# Altium schematic sheet PowerStage.SchDoc: Controlador PID
size A4; Organization: Altium Limited; Address1: L3, 12a Rodborough Rd; Address2: Frenchs Forest; Address3: NSW; Address4: Australia 2086; Revision: R00; sheetnumberh: 3; sheettotall: 5; Alumno: Irumberry Juan - Matwiejczuk Leandro; Curso: 512; Materia: Técnicas Digitales III; Docentes: Ing. Marín Ariel; SheetNumber: 3; SheetTotal: 5
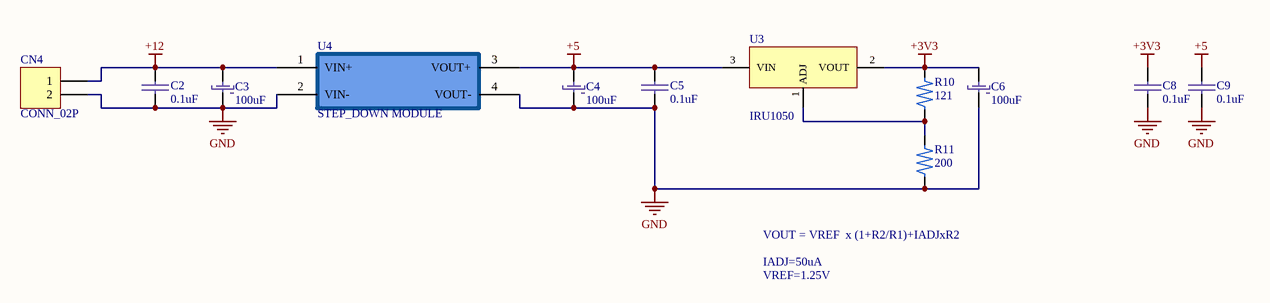
[diagram p0: PowerStage.SchDoc]

## Parts
C2  0.1uF  [CAP_Axial_0.2mm]
C3  100uF  [C_RAD_11MM]
C4  100uF  [C_RAD_5mm]
C5  0.1uF  [CAP_Axial_0.2mm]
C6  100uF  [C_RAD_5mm]
C8  0.1uF  [CAP_Axial_0.2mm]
C9  0.1uF  [CAP_Axial_0.2mm]
CN4  CONN_02P  [TERMINAL_BLOCK_2_PIN]
R10  121  [RES_AXIAL_3.2_6MM]
R11  200  [RES_AXIAL_3.2_6MM]
U3  IRU1050  [IRU1050]
U4  STEP_DOWN MODULE  [STEP_DOWN_MODULE]

## Nets
+3V3: C6.1 C8.1 R10.2 U3.2(VOUT)
+5: C4.1 C5.1 C9.1 U3.3(VIN) U4.3(VOUT+)
+12: C2.1 C3.1 CN4.1 U4.1(VIN+)
GND: C2.2 C3.2 C4.2 C5.2 C6.2 C8.2 C9.2 CN4.2 R11.1 U4.2(VIN-) U4.4(VOUT-)
NetR10_1: R10.1 R11.2 U3.1(ADJ)

## Notes on the sheet
- VOUT = VREF  x (1+R2/R1)+IADJxR2
- IADJ=50uA
- VREF=1.25V
- Title:
- Revision:
- Alumnos:
- Materia:
- Docente:
- Curso:
- File:
- Date:
- Sheet
- of

## Library data of the parts
C2 C5 C8 C9 = CAP_NP: Non-Polarized Capacitor
C3 C4 C6 = Cap_Pol: Polarized Capacitor
CN4 = CONN_02P: Connector Generic 2 Vias
R10 R11 = RES: Through-hole Resistor
U3 = IRU1050: 5A  LOW DROPOUT POSITIVEADJUSTABLE REGULATOR
U4 = STEP_DOWN_MODULE